# Altium schematic sheet motor.SchDoc
size A4
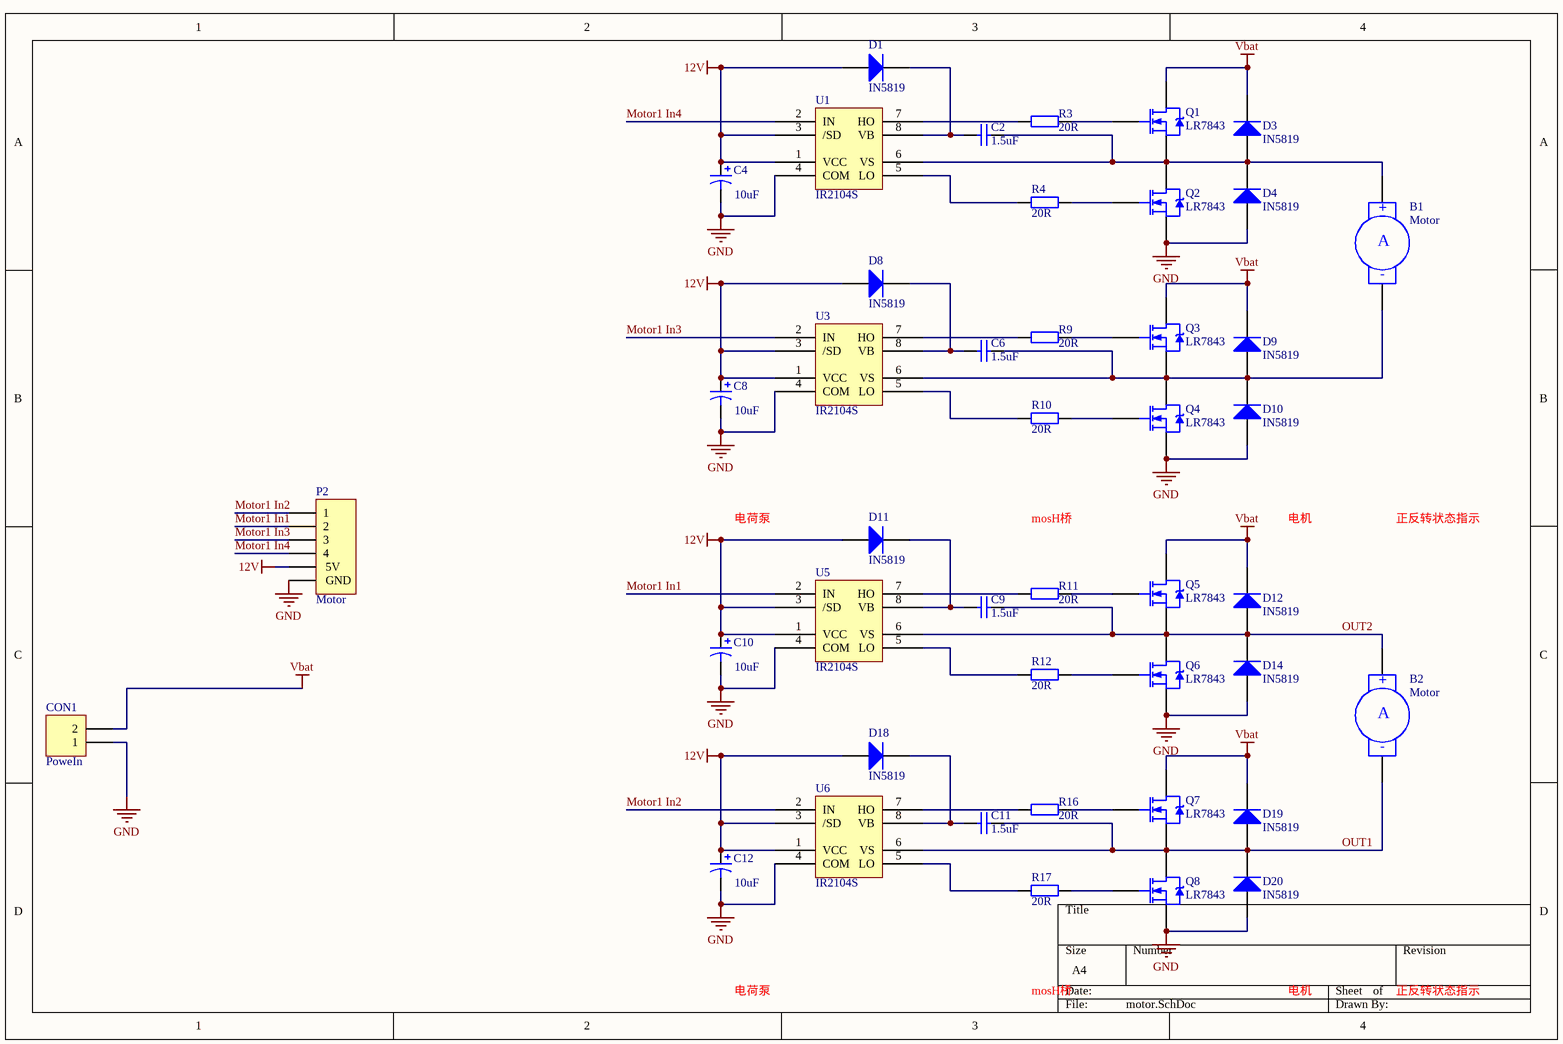
[diagram p0: motor.SchDoc]

## Parts
B1  Motor  [KF301-2P]
B2  Motor  [KF301-2P]
C2  1.5uF  [0805(2012)]
C4  10uF  [0805(2012)]
C6  1.5uF  [0805(2012)]
C8  10uF  [0805(2012)]
C9  1.5uF  [0805(2012)]
C10  10uF  [0805(2012)]
C11  1.5uF  [0805(2012)]
C12  10uF  [0805(2012)]
CON1  PoweIn  [POWER]
D1  IN5819  [1206(3216)]
D3  IN5819  [1206(3216)]
D4  IN5819  [1206(3216)]
D8  IN5819  [1206(3216)]
D9  IN5819  [1206(3216)]
D10  IN5819  [1206(3216)]
D11  IN5819  [1206(3216)]
D12  IN5819  [1206(3216)]
D14  IN5819  [1206(3216)]
D18  IN5819  [1206(3216)]
D19  IN5819  [1206(3216)]
D20  IN5819  [1206(3216)]
P2  Motor  [HDR1X6]
Q1  LR7843  [LR7843]
Q2  LR7843  [LR7843]
Q3  LR7843  [LR7843]
Q4  LR7843  [LR7843]
Q5  LR7843  [LR7843]
Q6  LR7843  [LR7843]
Q7  LR7843  [LR7843]
Q8  LR7843  [LR7843]
R3  20R  [0603]
R4  20R  [0603]
R9  20R  [0603]
R10  20R  [0603]
R11  20R  [0603]
R12  20R  [0603]
R16  20R  [0603]
R17  20R  [0603]
U1  IR2104S  [IR2104S]
U3  IR2104S  [IR2104S]
U5  IR2104S  [IR2104S]
U6  IR2104S  [IR2104S]

## Nets
12V: C4.1 C8.1 C10.1 C12.1 D1.1(A) D8.1(A) D11.1(A) D18.1(A) P2.5(5V) U1.1(VCC) U1.3(/SD) U3.1(VCC) U3.3(/SD) U5.1(VCC) U5.3(/SD) U6.1(VCC) U6.3(/SD)
GND: C4.2 C8.2 C10.2 C12.2 CON1.1 D4.1(A) D10.1(A) D14.1(A) D20.1(A) P2.6(GND) Q2.3(S) Q4.3(S) Q6.3(S) Q8.3(S) U1.4(COM) U3.4(COM) U5.4(COM) U6.4(COM)
Vbat: CON1.2 D3.2(K) D9.2(K) D12.2(K) D19.2(K) Q1.2(D) Q3.2(D) Q5.2(D) Q7.2(D)
Motor1 In1: P2.2 U5.2(IN)
Motor1 In2: P2.1 U6.2(IN)
Motor1 In3: P2.3 U3.2(IN)
Motor1 In4: P2.4 U1.2(IN)
OUT1: B2.2(-) C11.2 D19.1(A) D20.2(K) Q7.3(S) Q8.2(D) U6.6(VS)
OUT2: B2.1(+) C9.2 D12.1(A) D14.2(K) Q5.3(S) Q6.2(D) U5.6(VS)
NetB1_1: B1.1(+) C2.2 D3.1(A) D4.2(K) Q1.3(S) Q2.2(D) U1.6(VS)
NetB1_2: B1.2(-) C6.2 D9.1(A) D10.2(K) Q3.3(S) Q4.2(D) U3.6(VS)
NetC2_1: C2.1 D1.2(K) U1.8(VB)
NetC6_1: C6.1 D8.2(K) U3.8(VB)
NetC9_1: C9.1 D11.2(K) U5.8(VB)
NetC11_1: C11.1 D18.2(K) U6.8(VB)
NetQ1_1: Q1.1(G) R3.2
NetQ2_1: Q2.1(G) R4.2
NetQ3_1: Q3.1(G) R9.2
NetQ4_1: Q4.1(G) R10.2
NetQ5_1: Q5.1(G) R11.2
NetQ6_1: Q6.1(G) R12.2
NetQ7_1: Q7.1(G) R16.2
NetQ8_1: Q8.1(G) R17.2
NetR3_1: R3.1 U1.7(HO)
NetR4_1: R4.1 U1.5(LO)
NetR9_1: R9.1 U3.7(HO)
NetR10_1: R10.1 U3.5(LO)
NetR11_1: R11.1 U5.7(HO)
NetR12_1: R12.1 U5.5(LO)
NetR16_1: R16.1 U6.7(HO)
NetR17_1: R17.1 U6.5(LO)

## Notes on the sheet
- 电荷泵
- mosH桥
- 电机
- 正反转状态指示
- (in symbol Motor Servo) A

## Library data of the parts
B1 B2 = Motor Servo: Servo Motor; Published: 24-Mar-1999; LatestRevisionDate: 17-Jul-2002; LatestRevisionNote: Re-released for DXP Platform.; PackageReference: RAD-0.4; Publisher: Altium Limited; PackageDescription: Radial Cap, Thru-Hole; 2 Leads; 0.4 in Pin Spacing
C2 C6 C9 C11 = Cap Semi: Capacitor (Semiconductor SIM Model); Published: 8-Jun-2000; LatestRevisionDate: 29-May-2009; LatestRevisionNote: IPC-7351 Footprint Added.; PackageReference: C1206; Publisher: Altium Limited; PackageDescription: Chip Capacitor; Value: 1.5uF
C4 C8 C10 C12 = Cap Pol3: Polarized Capacitor (Surface Mount); Published: 8-Jun-2000; LatestRevisionDate: 29-May-2009; LatestRevisionNote: IPC-7351 Footprint Added.; PackageReference: C0805; Publisher: Altium Limited; PackageDescription: Chip Capacitor; Value: 10uF
CON1 = Header 2: Header, 2-Pin; LatestRevisionDate: 17-Jul-2002; LatestRevisionNote: Re-released for DXP Platform.; Publisher: Altium Limited
D1 D3 D4 D8-D12 D14 D18-D20 = Diode: Default Diode; Published: 8-Jun-2000; LatestRevisionDate: 17-Jul-2002; LatestRevisionNote: Re-released for DXP Platform.; PackageVersion: Sep-1996; PackageReference: SMC; Publisher: Altium Limited; PackageDescription: DO-214-AB/SMC; 2 C-Bend Leads; Body 7.9 x 5.9 mm, inc. leads (LxW); Code_JEDEC: DO-214-AB
Q1-Q8 = NMOS-2: N-Channel Power MOSFET; Note: Pin 2 is electrically connected to pin 4.; Published: 8-Jun-2000; LatestRevisionDate: 17-Jul-2002; LatestRevisionNote: Re-released for DXP Platform.; DatasheetVersion: PD-9.814; PackageVersion: Feb-1997; PackageReference: TO-220AB; Publisher: Altium Limited; PackageDescription: TO, Thru-Hole, Vertical, Heatsink Mounted; 3 In-Line Leads; Pitch 2.54 mm; ComponentLink1Description: Manufacturer Link; ComponentLink1URL: http://www.irf.com/
R3 R4 R9-R12 R16 R17 = Res2: Resistor; Published: 8-Jun-2000; LatestRevisionDate: 17-Jul-2002; LatestRevisionNote: Re-released for DXP Platform.; PackageReference: AXIAL-0.4; Publisher: Altium Limited; PackageDescription: Axial Device, Thru-Hole; 2 Leads; 0.4 in Pin Spacing; Value: 20R